# EAGLE design AirOwlPCBV7final (EAGLE 8.1.1)
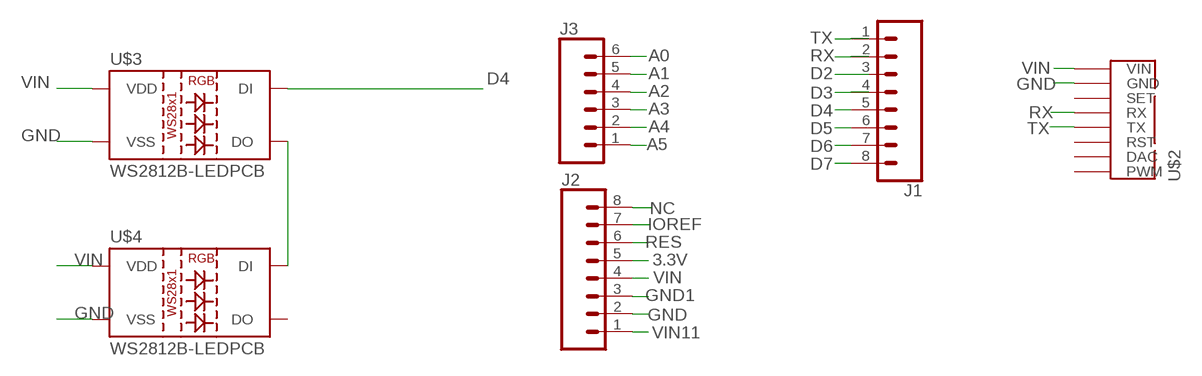
[diagram p0: schematic, sheet 1]

## Parts
J1  CONN_08"  [1X08]
J2  CONN_08"  [1X08]
J3  CONN_06SILK_FEMALE_PTH  [1X06]
U$2  WINSEN_CONNECTOR  [WINSEN_CONNECTOR]
U$3  WS2812B-LEDPCB  [WS2812B-LEDPCB]
U$4  WS2812B-LEDPCB  [WS2812B-LEDPCB]

## Nets
3.3V: J2.5
A0: J3.6
A1: J3.5
A2: J3.4
A3: J3.3
A4: J3.2
A5: J3.1
D2: J1.3
D3: J1.4
D4: J1.5 U$3.4(DI)
D5: J1.6
D6: J1.7
D7: J1.8
GND: J2.2 U$2.P$8(GND) U$3.3(VSS) U$4.3(VSS)
GND1: J2.3
IOREF: J2.7
N$1: U$3.2(DO) U$4.4(DI)
NC: J2.8
RES: J2.6
RX: J1.2 U$2.P$6(RX)
TX: J1.1 U$2.P$5(TX)
VIN: J2.4 U$2.P$9(VIN) U$3.1(VDD) U$4.1(VDD)
VIN11: J2.1
Unconnected: U$2.P$2(PWM) U$2.P$3(DAC) U$2.P$4(RST) U$2.P$7(SET) U$4.2(DO)

## Library data of the parts
J1 J2 = SparkFun-Connectors:CONN_08: Multi connection point. Often used as Generic Header-pin footprint for 0.1 inch spaced/style header connections On any of the 0.1 inch spaced packages, you can populate with these: Break Away Headers - Straight <https://www.sparkfun.com/products/116> (PRT-00116) Break Away Male Headers - Right Angle <https://www.sparkfun.com/products/553> (PRT-00553) Female Headers <https://www.sparkfun.com/products/115> (PRT-00115) Break Away Headers - Machine Pin <https://www.sparkfun.com/products/117> (PRT-00117) Break Away Female Headers - Swiss Machine Pin <https://www.sparkfun.com/products/743> (PRT-00743) Arduino Stackable Header - 8 Pin <https://www.sparkfun.com/products/9279> (PRT-09279) For SCREWTERMINALS and SPRING TERMINALS visit here: Screw Terimnals on SparkFun.com <https://www.sparkfun.com/search/results?term=Screw+Terminals> (5mm/3.5mm/2.54mm spacing) This device is also useful as a general connection point to wire up your design to another part of your project. Our various solder wires solder well into these plated through hole pads. Hook-Up Wire - Assortment (Stranded, 22 AWG) <https://www.sparkfun.com/products/11375> (PRT-11375) Hook-Up Wire - Assortment (Solid Core, 22 AWG) <https://www.sparkfun.com/products/11367> (PRT-11367) View the entire wire category on our website here <https://www.sparkfun.com/categories/141> Special notes: Molex polarized connector foot print use with SKU : PRT-08231 with associated crimp pins and housings. 1MM SMD Version SKU: PRT-10208 NOTES ON THE VARIANTS LOCK and LOCK_LONGPADS... This footprint was designed to help hold the alignment of a through-hole component (i.e. 6-pin header) while soldering it into place. You may notice that each hole has been shifted either up or down by 0.005 of an inch from it's more standard position (which is a perfectly straight line). This slight alteration caused the pins (the squares in the middle) to touch the edges of the holes. Because they are alternating, it causes a "brace" to hold the component in place. 0.005 has proven to be the perfect amount of "off-center" position when using our standard breakaway headers. Although looks a little odd when you look at the bare footprint, once you have a header in there, the alteration is very hard to notice. Also,if you push a header all the way into place, it is covered up entirely on the bottom side.; PROD_ID: CONN-08438
J3 = SparkFun-Connectors:CONN_06: Multi connection point. Often used as Generic Header-pin footprint for 0.1 inch spaced/style header connections On any of the 0.1 inch spaced packages, you can populate with these: Break Away Headers - Straight <https://www.sparkfun.com/products/116> (PRT-00116) Break Away Male Headers - Right Angle <https://www.sparkfun.com/products/553> (PRT-00553) Female Headers <https://www.sparkfun.com/products/115> (PRT-00115) Break Away Headers - Machine Pin <https://www.sparkfun.com/products/117> (PRT-00117) Break Away Female Headers - Swiss Machine Pin <https://www.sparkfun.com/products/743> (PRT-00743) Arduino Stackable Header - 6 Pin <https://www.sparkfun.com/products/9280> (PRT-09280) For SCREWTERMINALS and SPRING TERMINALS visit here: Screw Terimnals on SparkFun.com <https://www.sparkfun.com/search/results?term=Screw+Terminals> (5mm/3.5mm/2.54mm spacing) This device is also useful as a general connection point to wire up your design to another part of your project. Our various solder wires solder well into these plated through hole pads. Hook-Up Wire - Assortment (Stranded, 22 AWG) <https://www.sparkfun.com/products/11375> (PRT-11375) Hook-Up Wire - Assortment (Solid Core, 22 AWG) <https://www.sparkfun.com/products/11367> (PRT-11367) View the entire wire category on our website here <https://www.sparkfun.com/categories/141>; PROD_ID: CONN-08437
U$2 = OIZOM:WINSEN_CONNECTOR
U$3 U$4 = OIZOM:WS2812B-LEDPCB

## Board
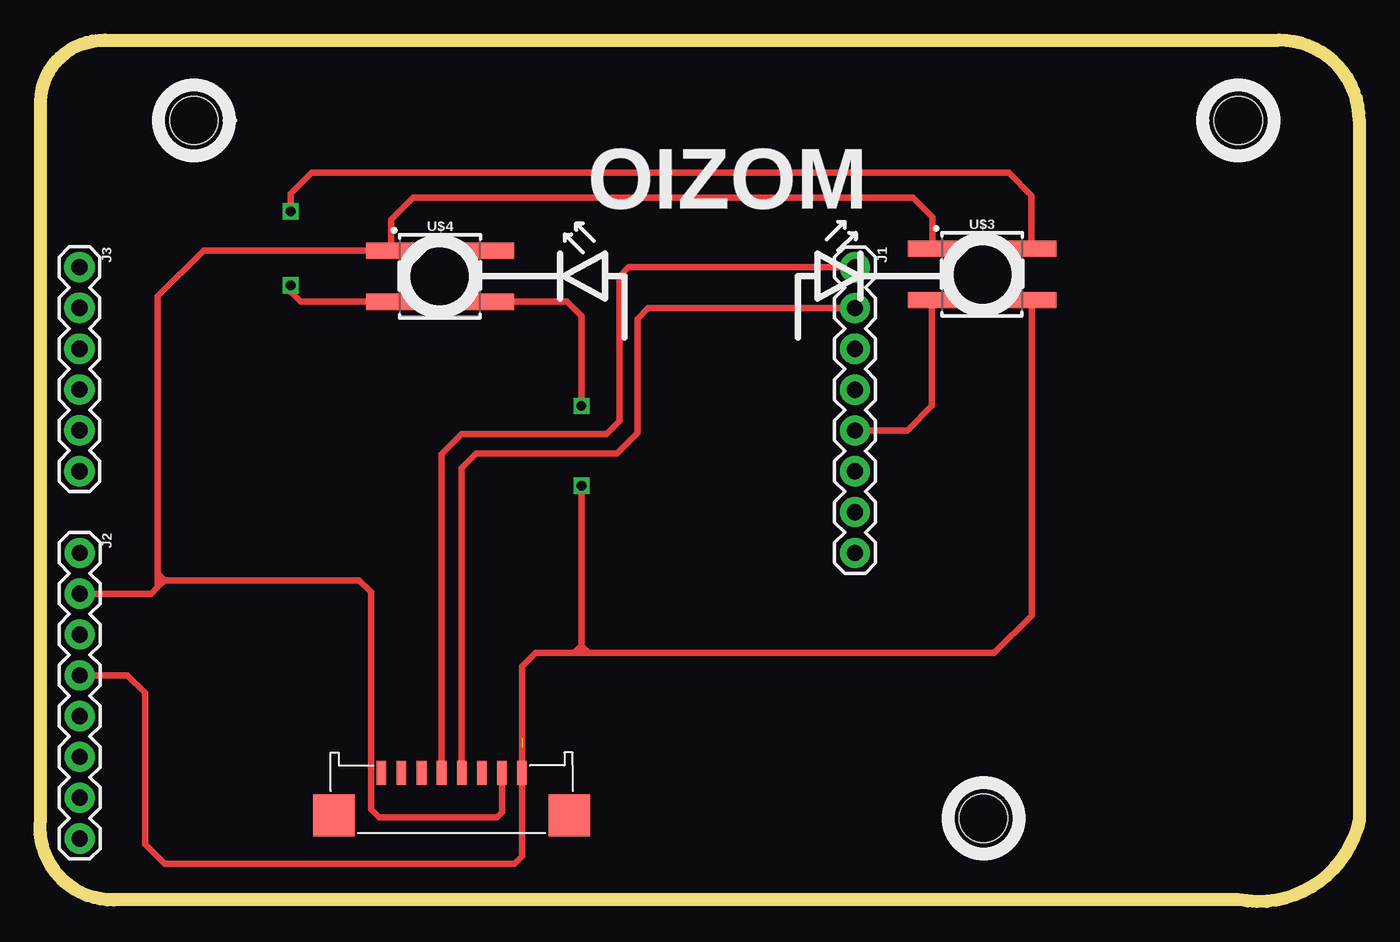
[diagram p1: board, top side]
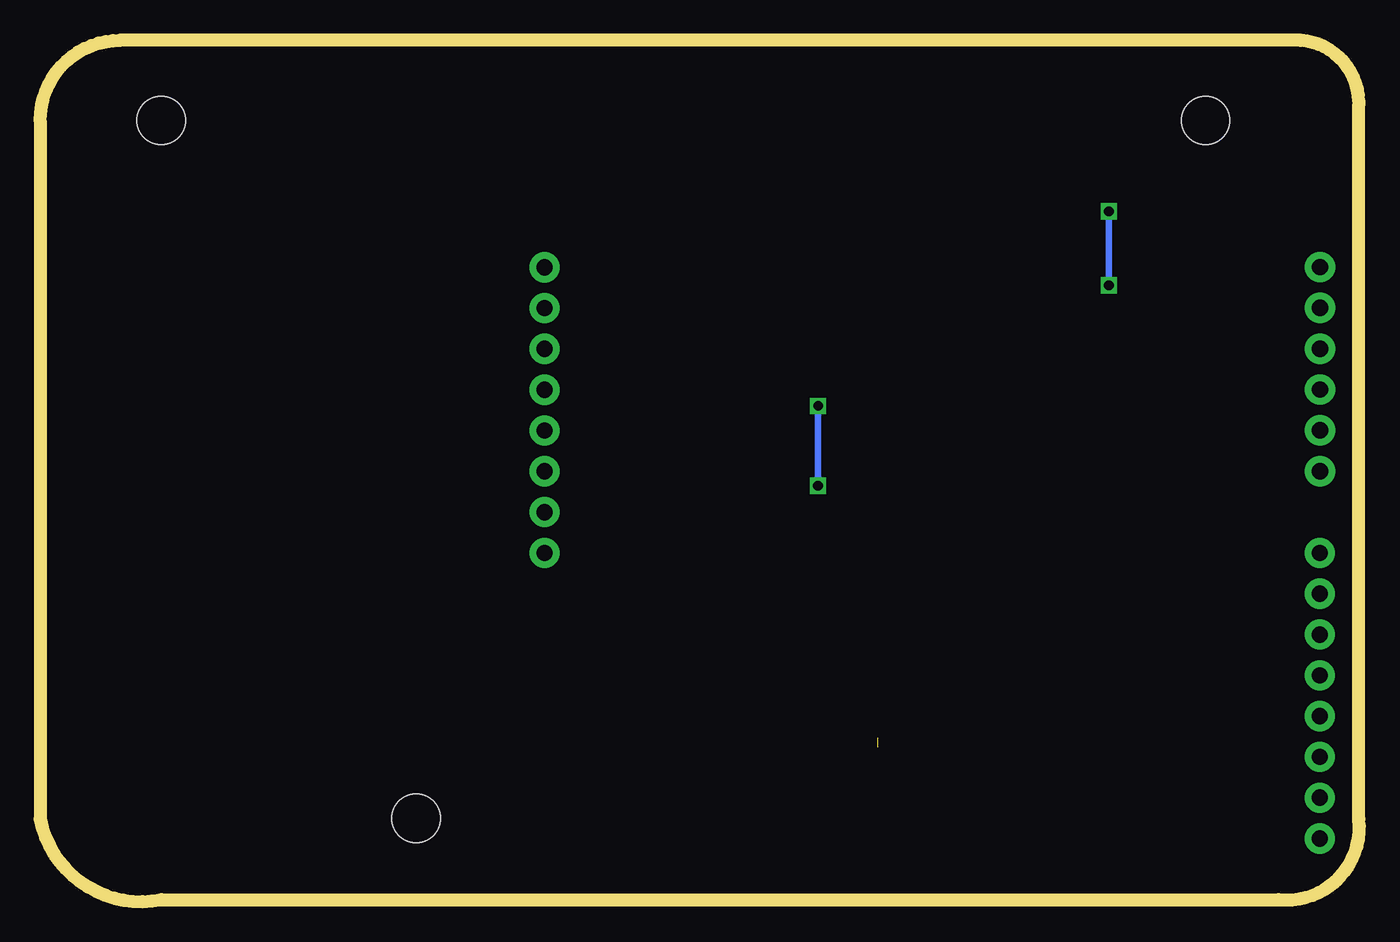
[diagram p2: board, bottom side, seen from below]

Size 82.11 x 53.63 mm. Coordinates in mm from the lower left corner, seen from the top.
Copper layers (1*16): Top 0.035mm / dielectric 1.5mm / Bottom 0.035mm
Design rules "default": minimum track width 6mil, minimum drill 0.35mm, track to track 6mil, track to pad 6mil, pad to pad 6mil, via to via 6mil, smd to smd 6mil, copper to edge 40mil, drill to drill 6mil, minimum pad ring 10mil, minimum via ring 8mil, stop-mask expansion 4mil, vias tented up to drill 0mil, thermal gap 10mil

### Footprints (pad centres in the part's own frame; a part is rotated, then mirrored left to right if it is on the bottom)
1X08 = drill 1.016 pad 1.88: 1 0,0; 2 2.54,0; 3 5.08,0; 4 7.62,0; 5 10.16,0; 6 12.7,0; 7 15.24,0; 8 17.78,0
1X06 = drill 1.016 pad 1.88: 1 0,0; 2 2.54,0; 3 5.08,0; 4 7.62,0; 5 10.16,0; 6 12.7,0
WINSEN_CONNECTOR = smd 2.6 x 2.6: P$1 0.2,1.1; P$10 14.85,1.1 | smd 0.6 x 1.5: P$2 3.15,3.75; P$3 4.4,3.75; P$4 5.65,3.75; P$5 6.9,3.75; P$6 8.15,3.75; P$7 9.4,3.75; P$8 10.65,3.75; P$9 11.9,3.75
WS2812B-LEDPCB = smd 3.048 x 1: 1 3.085,-1.6; 2 3.085,1.6; 3 -3.085,1.6; 4 -3.085,-1.6
AIROWLPCB-LIB = hole 3: 58.99,5.57; 9.84,49.02; 74.84,49.02

### Placement (x,y rotation side)
J1  50.72,39.49 270 top
J2  2.46,21.71 270 top
J3  2.45,39.5 270 top
U$2  18.09,4.28 0 top
U$3  58.63,39.06 0 top
U$4  24.89,38.94 0 top
U$5  [AIROWLPCB-LIB]  -0.27,-0.39 0 top

### Tracks (layer width: path | path; a pad name or v marks a point on that pad's centre or on a via)
D4
  Top 0.406: J1.5 53.98,29.33 55.52,30.87 55.52,37.43 U$3.4
GND
  Top 0.406: U$2.P$8 28.75,5.55 28.45,5.25 21.09,5.25 20.59,5.75 20.59,16.74 20.59,19.27 19.86,20.01 7.74,20.01 | 7.33,19.6 7.74,20.01 | 7.74,20.01 7.66,20.01 | 7.33,20.35 7.4,20.35 7.74,20.01 | 7.33,20.35 7.33,19.6 | J2.2 6.9,19.17 7.33,19.6 | 7.33,20.35 7.33,37.69 10.18,40.54 U$4.3 21.82,40.54 21.85,40.51 21.85,42.46 23.22,43.83 54.34,43.83 55.55,42.62 U$3.3
N$1  (via drill 0.6)
  Top 0.406: 22.47,37.24 U$4.4 16.21,37.34 15.65,37.9 15.6,37.95 15.6,38.43 15.59,38.42 v15.59,38.37 | v15.59,42.97 15.59,44.07 16.9,45.38 60.29,45.38 61.71,43.96 U$3.2
  Bottom 0.406: v15.59,38.37 v15.59,42.97
RX
  Top 0.406: 26.28,8.07 U$2.P$6 26.24,27 27.15,27.91 35.91,27.91 37.17,29.17 37.17,36.28 37.84,36.95 J1.2
TX
  Top 0.406: U$2.P$5 25,27.86 26.24,29.1 35.25,29.1 36.06,29.91 36.06,38.92 36.63,39.49 J1.1
VIN  (via drill 0.6)  (1 unrouted)
  Top 0.406: 30,10.2 U$2.P$9 30,5.54 30,2.81 29.53,2.34 7.75,2.34 6.53,3.57 6.53,12.99 5.43,14.09 J2.4 | U$3.1 61.71,17.82 59.37,15.48 34.1,15.48 33.69,15.89 33.7,15.9 33.7,15.93 33.71,15.93 34.16,15.48 34.27,15.48 33.24,15.48 | 29.99,9.6 29.99,14.63 30.84,15.48 33.24,15.48 | U$4.1 32.8,37.34 33.7,36.44 v33.7,30.87 v33.69,30.86 | v33.7,25.89 33.7,15.94 33.24,15.48
  Bottom 0.406: v33.69,30.86 v33.69,25.9 v33.7,25.89